# EAGLE design xxxled-a (EAGLE 6.6.0)
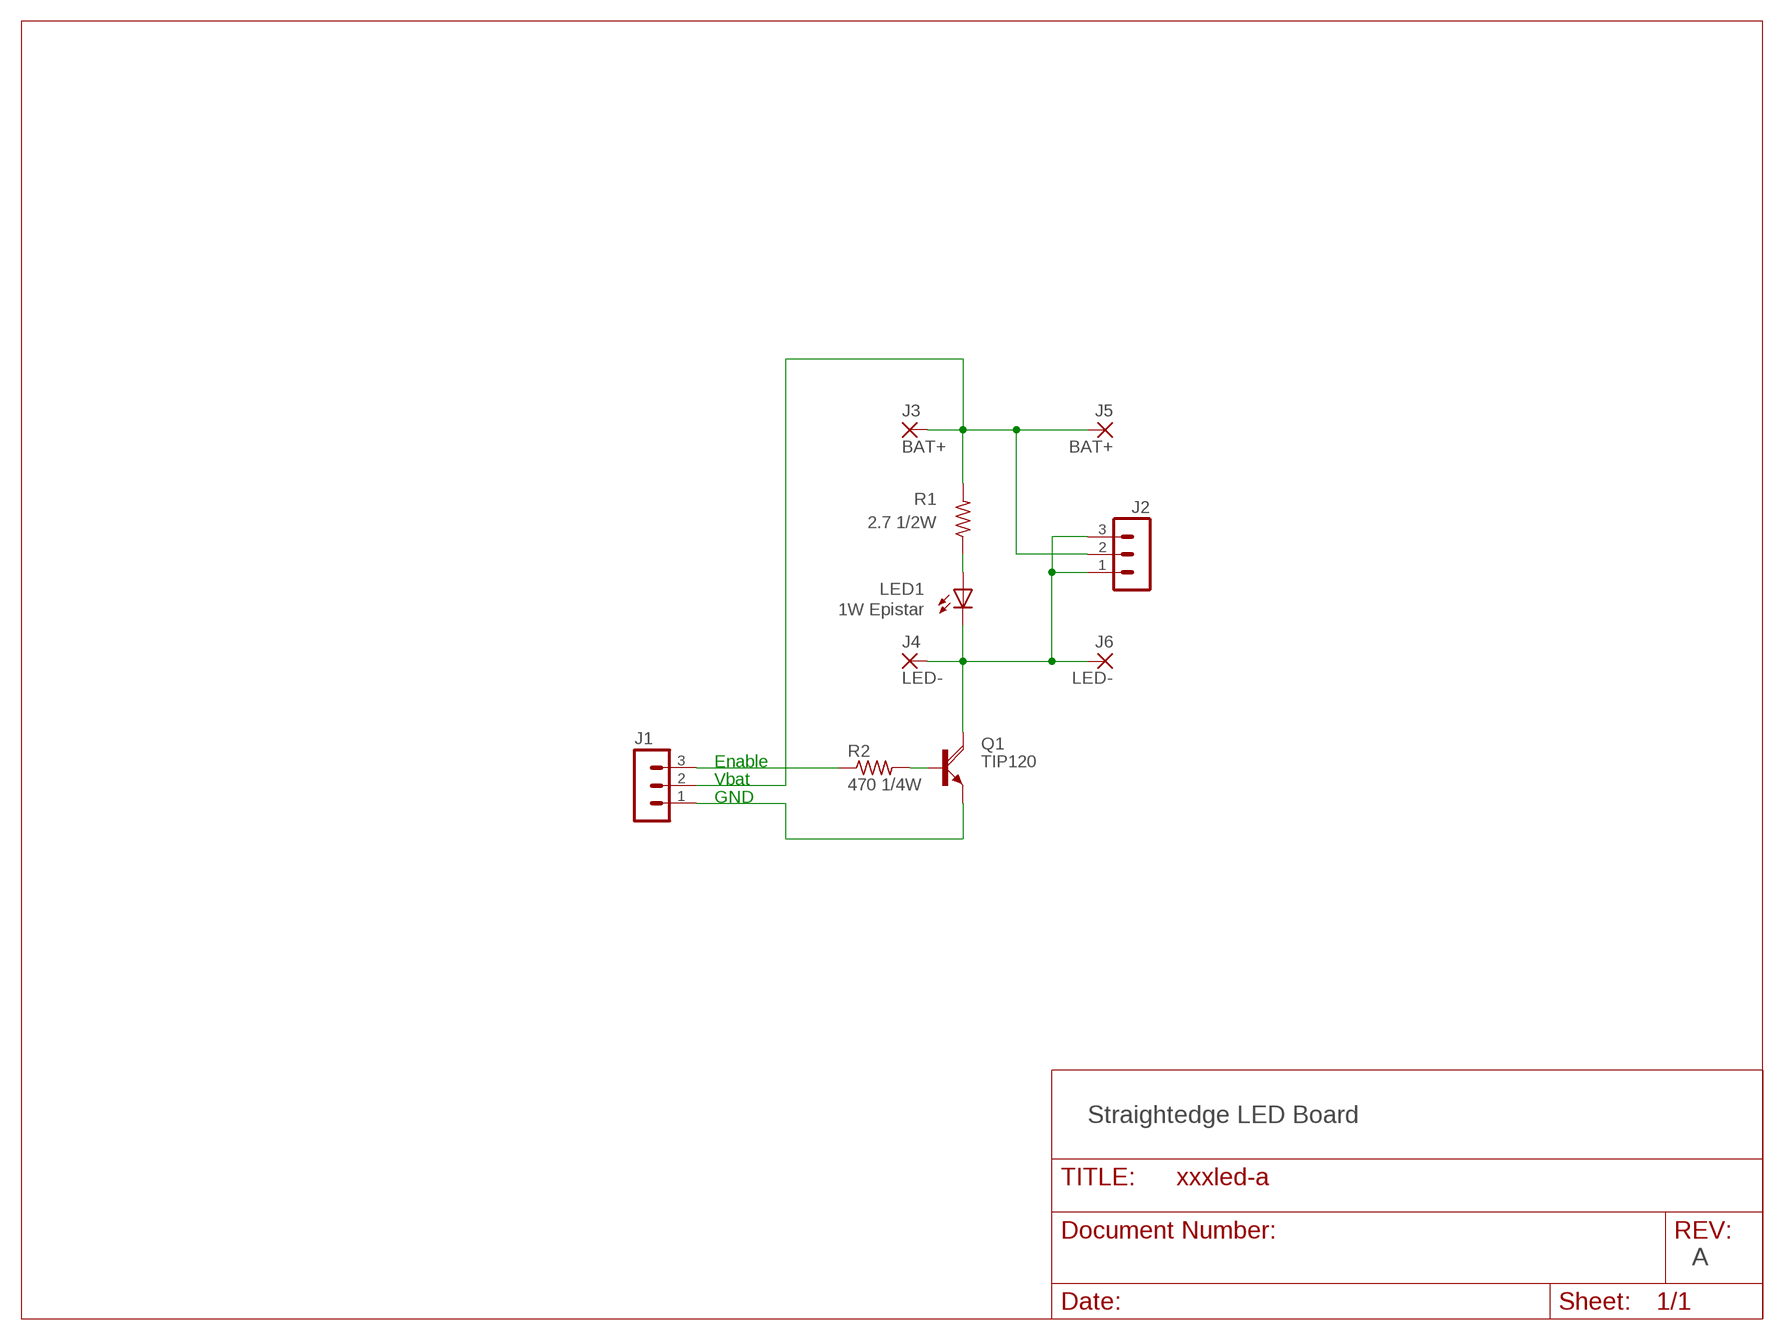
[diagram p0: schematic, sheet 1]

## Parts
J1  MA03-1  [MA03-1]
J2  MA03-1  [MA03-1]
J3  BAT+  WIREPAD2,54/1,1  [2,54/1,1]
J4  LED-  WIREPAD2,54/1,1  [2,54/1,1]
J5  BAT+  WIREPAD2,54/1,1  [2,54/1,1]
J6  LED-  WIREPAD2,54/1,1  [2,54/1,1]
LED1  1W Epistar  W49180EDGE  [POWER_LED_EDGE]
Q1  TIP120  [TO220AH]
R1  2.7 1/2W  R-US_0309/12  [0309/12]
R2  470 1/4W  R-US_0207/10  [0207/10]

## Nets
N$1: J1.3 R2.1
N$2: Q1.B R2.2
N$3: J2.1 J2.3 J4.1(P) J6.1(P) LED1.P$C(C) Q1.C
N$4: LED1.P$A(A) R1.1
N$5: J1.2 J2.2 J3.1(P) J5.1(P) R1.2
N$7: J1.1 Q1.E

## Notes on the sheet
- Enable
- Vbat
- GND
- Straightedge LED Board
- A

## Library data of the parts
J1 J2 = con-lstb:MA03-1: PIN HEADER; OC_FARNELL: unknown; OC_NEWARK: unknown
J3-J6 = wirepad:WIREPAD: Wire PAD connect wire on PCB
LED1 = xxxled:W49180: Z-Power LED P4 Series, Dome type Source: http://www.acriche.com .. W49180.pdf
Q1 = xxxled:TIP120: NPN DARLINGTON TRANSISTOR
R1 R2 = resistor:R-US_: RESISTOR, American symbol

## Board
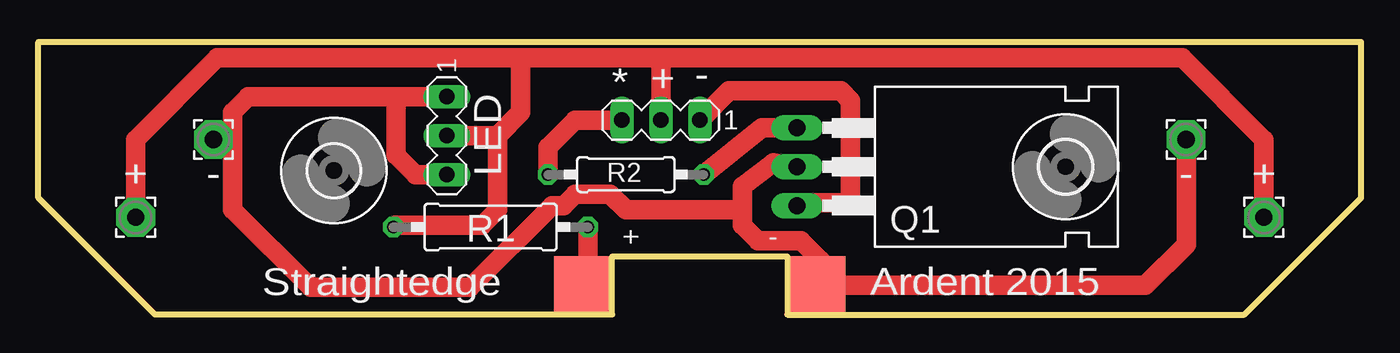
[diagram p1: board, top side]

Size 86.36 x 17.78 mm. Coordinates in mm from the lower left corner, seen from the top.
Outline: 37.47,0 37.47,3.81 48.9,3.81 48.9,0 78.74,0 86.36,7.62 86.36,17.78 0,17.78 0,7.62 7.62,0 37.47,0
Copper layers (1*16): Top 0.035mm / dielectric 1.5mm / Bottom 0.035mm
Design rules "default *": minimum track width 10mil, minimum drill 24mil, track to track 10mil, track to pad 10mil, pad to pad 10mil, via to via 10mil, smd to smd 10mil, copper to edge 40mil, drill to drill 8mil, minimum pad ring 10mil, minimum via ring 8mil, stop-mask expansion 4mil, vias tented up to drill 0mil, thermal gap 10mil

### Footprints (pad centres in the part's own frame; a part is rotated, then mirrored left to right if it is on the bottom)
MA03-1 = drill 1.016 long: 1 -2.54,0; 2 0,0; 3 2.54,0
2,54/1,1 = drill 1.118 pad 2.54 octagon: 1 0,0
POWER_LED_EDGE = smd 3.81 x 3.81: P$A -7.62,-1.905; P$C 7.62,-1.905
TO220AH = drill 1.118 long: B -2.54,-6.35; C 0,-6.35; E 2.54,-6.35 | hole 3.302: 0,11.176
0309/12 = drill 0.813 octagon: 1 -6.35,0; 2 6.35,0
0207/10 = drill 0.813 octagon: 1 -5.08,0; 2 5.08,0
3,3 = hole 3.3: 0,0

### Placement (x,y rotation side)
J1  40.64,12.7 180 top
J2  26.67,11.68 270 top
J3  6.35,6.35 0 top
J4  74.93,11.43 0 top
J5  80.01,6.35 0 top
J6  11.43,11.43 0 top
LED1  43.18,3.81 0 top
Q1  55.88,9.65 270 top
R1  29.53,5.71 180 top
R2  38.35,9.14 0 top
U$1  [3,3]  67.06,9.65 0 top
U$2  [3,3]  19.3,9.4 0 top

### Tracks (layer width: path | path; a pad name or v marks a point on that pad's centre or on a via)
N$1
  Top 1.27: J1.3 35.05,12.7 33.27,10.92 R2.1
N$2
  Top 1.27: Q1.B 47.24,12.19 R2.2
N$3
  Top 1.27: J4.1 74.93,4.57 72.26,1.91 LED1.P$C | Q1.C 48.01,9.91 45.97,8.38 45.97,6.86 | 45.97,6.86 45.97,5.84 46.99,4.83 49.78,4.83 51.05,3.56 51.05,3.05 | 51.05,3.05 50.8,2.79 LED1.P$C | LED1.P$C 50.93,2.03 51.31,2.03 51.05,2.29 51.05,3.05 | 45.97,6.86 38.35,6.86 37.34,7.87 35.05,7.87 34.29,7.11 33.53,7.11 28.19,1.78 17.78,1.78 12.7,6.86 12.7,11.43 | 12.7,11.43 12.7,13.21 13.72,14.22 23.37,14.22 | 23.37,14.22 J2.1 | J2.3 24.64,9.14 23.37,10.41 23.37,14.22 | J6.1 12.7,11.43
N$4
  Top 1.27: R1.1 35.88,2.86 LED1.P$A
N$5
  Top 1.27: J3.1 6.35,11.43 11.68,16.76 31.5,16.76 | 31.5,16.76 40.64,16.76 | 40.64,16.76 74.68,16.76 80.01,11.43 J5.1 | J1.2 40.64,16.76 | J2.2 29.97,11.68 | 29.97,11.68 31.5,13.21 31.5,16.76 | R1.2 23.3,5.84 28.96,5.84 29.97,6.86 29.97,11.68
N$7
  Top 1.27: Q1.E 49.59,7.3 53.02,7.3 53.02,13.97 52.39,14.61 45.09,14.61 J1.1

### Text on the board
tPlace: + | - | * | LED | + | - | - | + | Straightedge | Ardent 2015